# EAGLE design FrequencyCounter (EAGLE 7.2.0)
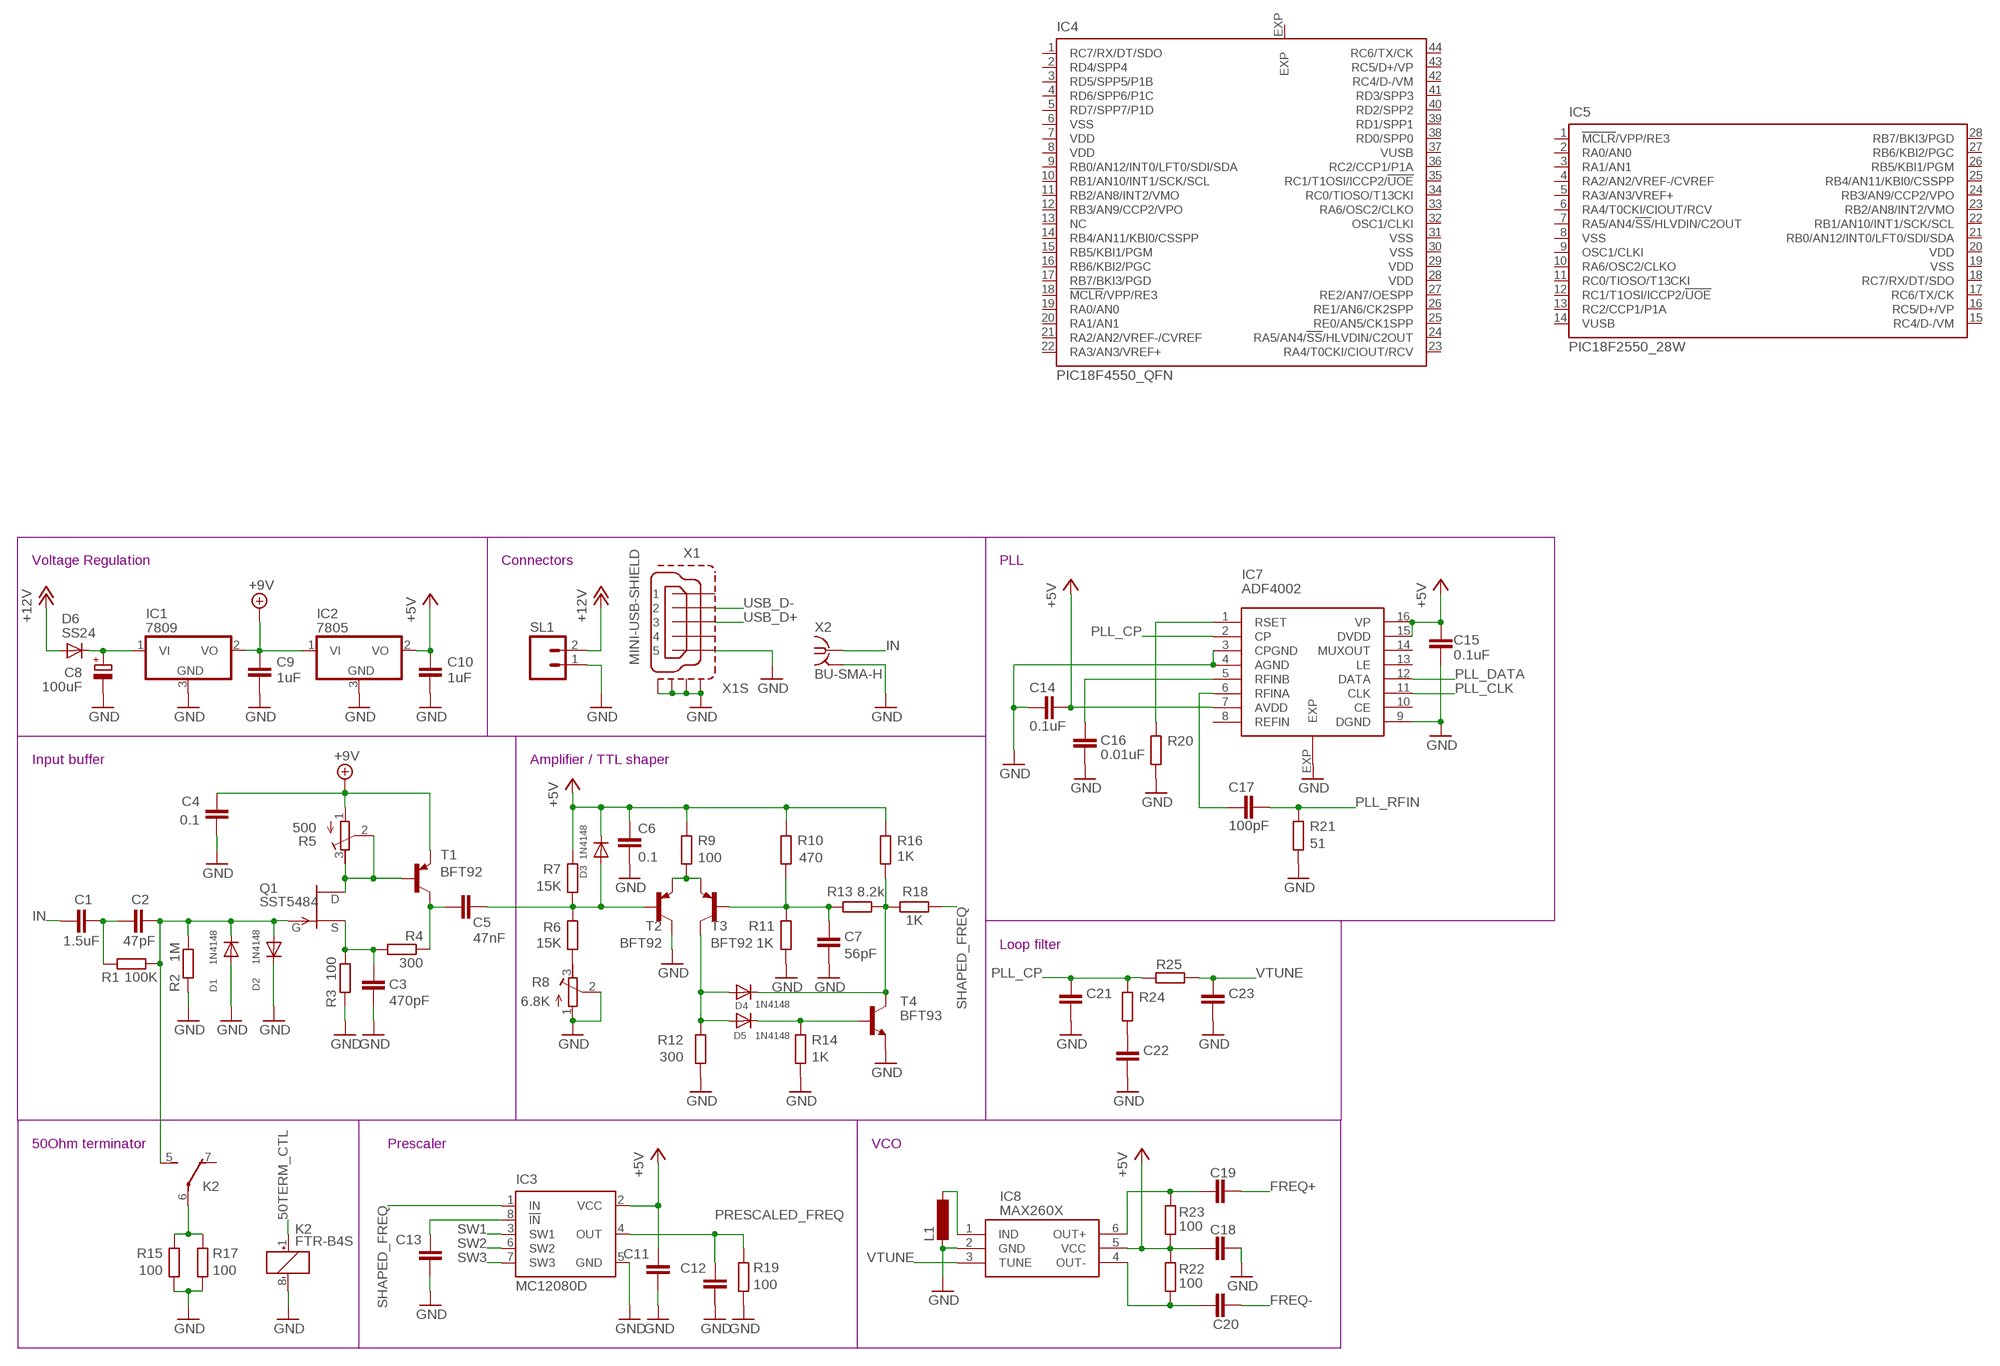
[diagram p0: schematic, sheet 1, part 1 of 2]
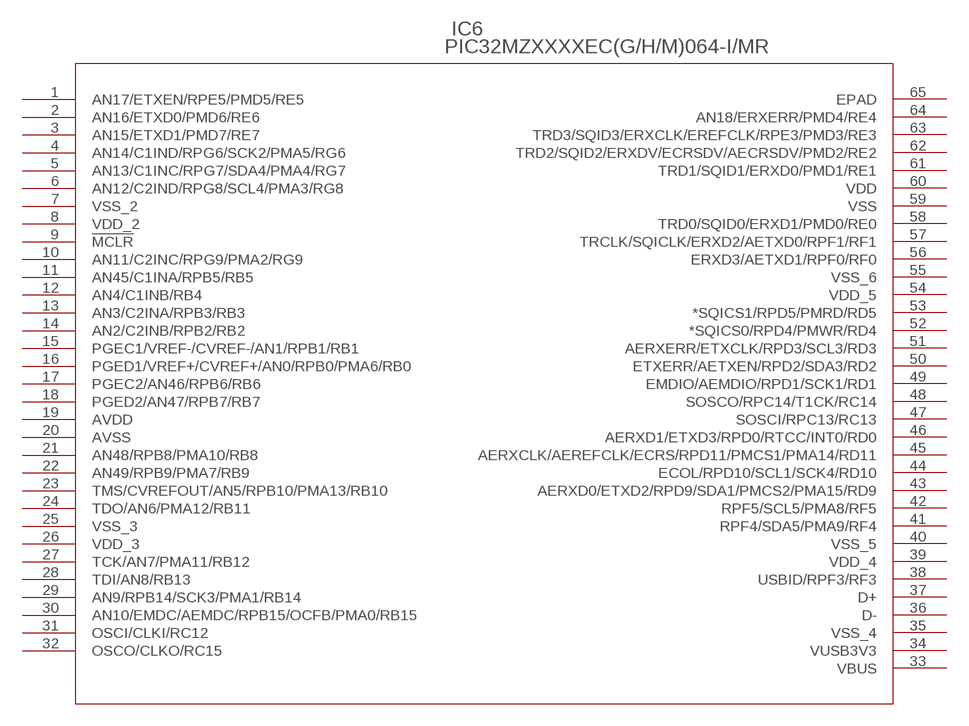
[diagram p1: schematic, sheet 1, part 2 of 2]

## Parts
C1  1.5uF  C-EUC0805  [C0805]
C2  47pF  C-EUC0805  [C0805]
C3  470pF  C-EUC0805  [C0805]
C4  0.1  C-EUC0805  [C0805]
C5  47nF  C-EUC0805  [C0805]
C6  0.1  C-EUC0805  [C0805]
C7  56pF  C-EUC0805  [C0805]
C8  100uF  CPOL-EUD/7343-31R  [D/7343-31R]
C9  1uF  C-EUC0805  [C0805]
C10  1uF  C-EUC0805  [C0805]
C11  C-EUC0805  [C0805]
C12  C-EUC0805  [C0805]
C13  C-EUC0805  [C0805]
C14  0.1uF  C-EUC0805  [C0805]
C15  0.1uF  C-EUC0805  [C0805]
C16  0.01uF  C-EUC0805  [C0805]
C17  100pF  C-EUC0805  [C0805]
C18  C-EUC0805  [C0805]
C19  C-EUC0805  [C0805]
C20  C-EUC0805  [C0805]
C21  C-EUC0805  [C0805]
C22  C-EUC0805  [C0805]
C23  C-EUC0805  [C0805]
D1  1N4148  DIODESOD-123  [SOD-123]
D2  1N4148  DIODESOD-123  [SOD-123]
D3  1N4148  DIODESOD-123  [SOD-123]
D4  1N4148  DIODESOD-123  [SOD-123]
D5  1N4148  DIODESOD-123  [SOD-123]
D6  SS24  DIODE-DO214AA  [DO214AA]
IC1  7809  7806DT  [TO252]
IC2  7805  7806DT  [TO252]
IC3  MC12080D  [SO08]
IC4  PIC18F4550_QFN  [QFN44ML8X8]
IC5  PIC18F2550_28W  [SO28W]
IC6  PIC32MZXXXXEC(G/H/M)064-I/MR  [QFN64_9X9MC]
IC7  ADF4002  ADF4001  [LFCSP16]
IC8  MAX260X  [SOT-23-6]
K2  FTR-B4S  [FTR-B4S]
L1  L-EUL3225P  [L3225P]
Q1  SST5484  [SOT23]
R1  100K  R-EU_R0805  [R0805]
R2  1M  R-EU_R0805  [R0805]
R3  100  R-EU_R0805  [R0805]
R4  300  R-EU_R0805  [R0805]
R5  500  R-TRIMM4G/J  [RTRIM4G/J]
R6  15K  R-EU_R0805  [R0805]
R7  15K  R-EU_R0805  [R0805]
R8  6.8K  R-TRIMM4G/J  [RTRIM4G/J]
R9  100  R-EU_R0805  [R0805]
R10  470  R-EU_R0805  [R0805]
R11  1K  R-EU_R0805  [R0805]
R12  300  R-EU_R0805  [R0805]
R13  8.2k  R-EU_R0805  [R0805]
R14  1K  R-EU_R0805  [R0805]
R15  100  R-EU_R0805  [R0805]
R16  1K  R-EU_R0805  [R0805]
R17  100  R-EU_R0805  [R0805]
R18  1K  R-EU_R0805  [R0805]
R19  100  R-EU_R0805  [R0805]
R20  R-EU_R0805  [R0805]
R21  51  R-EU_R0805  [R0805]
R22  100  R-EU_R0805  [R0805]
R23  100  R-EU_R0805  [R0805]
R24  R-EU_R0805  [R0805]
R25  R-EU_R0805  [R0805]
SL1  M02  [02P]
T1  BFT92  BC807-16-PNP-SOT23-BEC  [SOT23-BEC]
T2  BFT92  BC807-16-PNP-SOT23-BEC  [SOT23-BEC]
T3  BFT92  BC807-16-PNP-SOT23-BEC  [SOT23-BEC]
T4  BFT93  BC808-NPN-SOT23-BEC  [SOT23-BEC]
X1  MINI-USB-SHIELD  MINI-USB-SHIELD-UX60A-MB-5ST  [UX60A-MB-5ST]
X2  BU-SMA-H  [BU-SMA-H]

## Nets
50TERM_CTL: K2.1(K:+)
+5V: C6.1 C10.1 C11.1 C14.1 C15.2 C18.1 D3.C IC2.2(VO) IC3.2(VCC) IC7.7(AVDD) IC7.15(DVDD) IC7.16(VP) IC8.5(VCC) R7.1 R9.1 R10.1 R16.1 R22.2 R23.1
+9V: C4.1 C9.1 IC1.2(VO) IC2.1(VI) R5.1(A) T1.E
+12V: D6.A SL1.2
FREQ+: C19.2
FREQ-: C20.2
GND: C3.2 C4.2 C6.2 C7.1 C8.- C9.2 C10.2 C11.2 C12.2 C13.2 C14.2 C15.1 C16.2 C18.2 C21.1 C22.1 C23.1 D1.A D2.C IC1.3(GND) IC2.3(GND) IC3.5(GND) IC7.3(CPGND) IC7.4(AGND) IC7.9(DGND) IC7.EXP IC8.2(GND) K2.8(K:-) L1.2 R2.2 R3.2 R8.1(A) R8.2(S) R11.2 R12.2 R14.2 R15.2 R17.2 R19.2 R20.2 R21.2 SL1.1 T2.C T4.E X1.5 X1.M1(S1) X1.M2(S2) X1.M3(S3) X1.M4(S4) X2.2 X2.3 X2.4 X2.5
IN: C1.1 X2.1
N$1: C2.2 D1.C D2.A K2.5(-2:S) Q1.3(G) R1.1 R2.1
N$2: C1.2 C2.1 R1.2
N$3: C3.1 Q1.2(S) R3.1 R4.2
N$4: Q1.1(D) R5.2(S) R5.3(E) T1.B
N$5: C5.2 R4.1 T1.C
N$6: R6.2 R8.3(E)
N$7: C5.1 D3.A R6.1 R7.2 T2.B
N$8: R9.2 T2.E T3.E
N$9: C7.2 R10.2 R11.1 R13.2 T3.B
N$10: D4.A D5.A R12.1 T3.C
N$11: D4.C R13.1 R16.2 R18.2 T4.C
N$12: D5.C R14.1 T4.B
N$13: C8.+ D6.C IC1.1(VI)
N$14: K2.6(-2:P) R15.1 R17.1
N$15: C16.1 IC7.5(RFINB)
N$16: C13.1 IC3.8(!IN)
N$17: IC7.1(RSET) R20.1
N$18: C17.2 IC7.6(RFINA)
N$19: IC8.1(IND) L1.1
N$20: C20.1 IC8.4(OUT-) R22.1
N$21: C19.1 IC8.6(OUT+) R23.2
N$22: C22.2 R24.2
PLL_CLK: IC7.11(CLK)
PLL_CP: C21.2 IC7.2(CP) R24.1 R25.1
PLL_DATA: IC7.12(DATA)
PLL_RFIN: C17.1 R21.1
PRESCALED_FREQ: C12.1 IC3.4(OUT) R19.1
SHAPED_FREQ: IC3.1(IN) R18.1
SW1: IC3.3(SW1)
SW2: IC3.6(SW2)
SW3: IC3.7(SW3)
USB_D+: X1.3
USB_D-: X1.2
VTUNE: C23.2 IC8.3(TUNE) R25.2
Unconnected: IC4.1(RC7/RX/DT/SDO) IC4.2(RD4/SPP4) IC4.3(RD5/SPP5/P1B) IC4.4(RD6/SPP6/P1C) IC4.5(RD7/SPP7/P1D) IC4.9(RB0/AN12/INT0/LFT0/SDI/SDA) IC4.10(RB1/AN10/INT1/SCK/SCL) IC4.11(RB2/AN8/INT2/VMO) IC4.12(RB3/AN9/CCP2/VPO) IC4.13(NC) IC4.14(RB4/AN11/KBI0/CSSPP) IC4.15(RB5/KBI1/PGM) IC4.16(RB6/KBI2/PGC) IC4.17(RB7/BKI3/PGD) IC4.18(!MCLR!/VPP/RE3) IC4.19(RA0/AN0) IC4.20(RA1/AN1) IC4.21(RA2/AN2/VREF-/CVREF) IC4.22(RA3/AN3/VREF+) IC4.23(RA4/T0CKI/CIOUT/RCV) IC4.24(RA5/AN4/!SS!/HLVDIN/C2OUT) IC4.25(RE0/AN5/CK1SPP) IC4.26(RE1/AN6/CK2SPP) IC4.27(RE2/AN7/OESPP) IC4.32(OSC1/CLKI) IC4.33(RA6/OSC2/CLKO) IC4.34(RC0/TIOSO/T13CKI) IC4.35(RC1/T1OSI/ICCP2/!UOE) IC4.36(RC2/CCP1/P1A) IC4.37(VUSB) IC4.38(RD0/SPP0) IC4.39(RD1/SPP1) IC4.40(RD2/SPP2) IC4.41(RD3/SPP3) IC4.42(RC4/D-/VM) IC4.43(RC5/D+/VP) IC4.44(RC6/TX/CK) IC4.EXP IC5.1(!MCLR!/VPP/RE3) IC5.2(RA0/AN0) IC5.3(RA1/AN1) IC5.4(RA2/AN2/VREF-/CVREF) IC5.5(RA3/AN3/VREF+) IC5.6(RA4/T0CKI/CIOUT/RCV) IC5.7(RA5/AN4/!SS!/HLVDIN/C2OUT) IC5.9(OSC1/CLKI) IC5.10(RA6/OSC2/CLKO) IC5.11(RC0/TIOSO/T13CKI) IC5.12(RC1/T1OSI/ICCP2/!UOE) IC5.13(RC2/CCP1/P1A) IC5.14(VUSB) IC5.15(RC4/D-/VM) IC5.16(RC5/D+/VP) IC5.17(RC6/TX/CK) IC5.18(RC7/RX/DT/SDO) IC5.21(RB0/AN12/INT0/LFT0/SDI/SDA) IC5.22(RB1/AN10/INT1/SCK/SCL) IC5.23(RB2/AN8/INT2/VMO) IC5.24(RB3/AN9/CCP2/VPO) IC5.25(RB4/AN11/KBI0/CSSPP) IC5.26(RB5/KBI1/PGM) IC5.27(RB6/KBI2/PGC) IC5.28(RB7/BKI3/PGD) IC6.1(AN17/ETXEN/RPE5/PMD5/RE5) IC6.2(AN16/ETXD0/PMD6/RE6) IC6.3(AN15/ETXD1/PMD7/RE7) IC6.4(AN14/C1IND/RPG6/SCK2/PMA5/RG6) IC6.5(AN13/C1INC/RPG7/SDA4/PMA4/RG7) IC6.6(AN12/C2IND/RPG8/SCL4/PMA3/RG8) IC6.9(!MCLR!) IC6.10(AN11/C2INC/RPG9/PMA2/RG9) IC6.11(AN45/C1INA/RPB5/RB5) IC6.12(AN4/C1INB/RB4) IC6.13(AN3/C2INA/RPB3/RB3) IC6.14(AN2/C2INB/RPB2/RB2) IC6.15(PGEC1/VREF-/CVREF-/AN1/RPB1/RB1) IC6.16(PGED1/VREF+/CVREF+/AN0/RPB0/PMA6/RB0) IC6.17(PGEC2/AN46/RPB6/RB6) IC6.18(PGED2/AN47/RPB7/RB7) IC6.21(AN48/RPB8/PMA10/RB8) IC6.22(AN49/RPB9/PMA7/RB9) IC6.23(TMS/CVREFOUT/AN5/RPB10/PMA13/RB10) IC6.24(TDO/AN6/PMA12/RB11) IC6.27(TCK/AN7/PMA11/RB12) IC6.28(TDI/AN8/RB13) IC6.29(AN9/RPB14/SCK3/PMA1/RB14) IC6.30(AN10/EMDC/AEMDC/RPB15/OCFB/PMA0/RB15) IC6.31(OSCI/CLKI/RC12) IC6.32(OSCO/CLKO/RC15) IC6.36(D-) IC6.37(D+) IC6.38(USBID/RPF3/RF3) IC6.41(RPF4/SDA5/PMA9/RF4) IC6.42(RPF5/SCL5/PMA8/RF5) IC6.43(AERXD0/ETXD2/RPD9/SDA1/PMCS2/PMA15/RD9) IC6.44(ECOL/RPD10/SCL1/SCK4/RD10) IC6.45(AERXCLK/AEREFCLK/ECRS/RPD11/PMCS1/PMA14/RD11) IC6.46(AERXD1/ETXD3/RPD0/RTCC/INT0/RD0) IC6.47(SOSCI/RPC13/RC13) IC6.48(SOSCO/RPC14/T1CK/RC14) IC6.49(EMDIO/AEMDIO/RPD1/SCK1/RD1) IC6.50(ETXERR/AETXEN/RPD2/SDA3/RD2) IC6.51(AERXERR/ETXCLK/RPD3/SCL3/RD3) IC6.52(*SQICS0/RPD4/PMWR/RD4) IC6.53(*SQICS1/RPD5/PMRD/RD5) IC6.56(ERXD3/AETXD1/RPF0/RF0) IC6.57(TRCLK/SQICLK/ERXD2/AETXD0/RPF1/RF1) IC6.58(TRD0/SQID0/ERXD1/PMD0/RE0) IC6.61(TRD1/SQID1/ERXD0/PMD1/RE1) IC6.62(TRD2/SQID2/ERXDV/ECRSDV/AECRSDV/PMD2/RE2) IC6.63(TRD3/SQID3/ERXCLK/EREFCLK/RPE3/PMD3/RE3) IC6.64(AN18/ERXERR/PMD4/RE4) IC6.65(EPAD) IC7.8(REFIN) IC7.10(CE) IC7.13(LE) IC7.14(MUXOUT) K2.2(-1:O) K2.3(-1:P) K2.4(-1:S) K2.7(-2:O) X1.1 X1.4

## Notes on the sheet
- Voltage Regulation | Connectors | PLL
- Input buffer | Amplifier / TTL shaper
- Loop filter
- 50Ohm terminator | Prescaler | VCO

## Power pins joined to a net without a drawn wire
AVDD: IC6.19(AVDD)
AVSS: IC6.20(AVSS)
VBUS: IC6.33(VBUS)
VDD: IC4.7(VDD) IC4.8(VDD) IC4.28(VDD) IC4.29(VDD) IC5.20(VDD) IC6.60(VDD)
VDD_2: IC6.8(VDD_2)
VDD_3: IC6.26(VDD_3)
VDD_4: IC6.39(VDD_4)
VDD_5: IC6.54(VDD_5)
VSS: IC4.6(VSS) IC4.30(VSS) IC4.31(VSS) IC5.8(VSS) IC5.19(VSS) IC6.59(VSS)
VSS_2: IC6.7(VSS_2)
VSS_3: IC6.25(VSS_3)
VSS_4: IC6.35(VSS_4)
VSS_5: IC6.40(VSS_5)
VSS_6: IC6.55(VSS_6)
VUSB3V3: IC6.34(VUSB3V3)

## Library data of the parts
C1-C7 C9-C23 = rcl:C-EU: CAPACITOR, European symbol
C8 = rcl:CPOL-EU: POLARIZED CAPACITOR, European symbol
D1-D5 = adafruit:DIODE: Diode SMADIODE - SMA Surface Mount Package 20V 1A Schottky Diode Digikey: 641-1014-6-ND DO-1N4148 - Through Hole Small Current Diode SOD-123 20V 1 A (.5mV Vf) Schottky Diode - Digikey: MBRX120TPMSCT-ND SOD-323 10V 570mA (.38mV Vf, 3ns) Schottky Diode - Digikey: ZLLS410CT-ND SOD-523 30V 30mA Schottky Diode (RB751S-40TE61) - Digikey: RB751S-40TE61CT-ND SOT23-R/W - SOT23 Package (R = Solder Paste/Reflow Ovens, W = Hand-Soldering) BAT54Film 40V 300mA - Digikey: 497-7162-1-ND
D6 = diode:DIODE-: DIODE
IC1 IC2 = linear:78*: Positive VOLTAGE REGULATOR Source: http://cache.national.com/ds/LM/LM78L05.pdf http://www.fairchildsemi.com/ds/LM/LM7805.pdf
IC3 = on-semiconductor:MC12080: 1.1 GHz Prescaler MECL PLL COMPONENTS ÷10/20/40/80 PRESCALER Source: http://motorola.com/sps .. MC12080.pdf; MF: ON SEMICONDUCTOR; MPN: MC12080D; OC_FARNELL: 1607924; OC_NEWARK: 40C2542
IC4 = microchip:PIC18F4*_QFN: USB Microcontrollers with nanoWatt Technology High-Performance, Enhanced Flash, 28/40/44-Pin, Source: http://ww1.microchip.com/downloads/en/devicedoc/39632c.pdf; MF: MICROCHIP; MPN: PIC18F4550-I/ML; OC_FARNELL: 1292276; OC_NEWARK: 08J9631
IC5 = microchip:PIC18F2*_28: USB Microcontrollers with nanoWatt Technology High-Performance, Enhanced Flash, 28/40/44-Pin, Source: http://ww1.microchip.com/downloads/en/devicedoc/39632c.pdf; MF: MICROCHIP; MPN: PIC18F2550-I/SO; OC_FARNELL: 9321268; OC_NEWARK: 73K1297
IC6 = own-collection:PIC32MZXXXXEC(G/H/M)064-I/MR; MANUFACTURER_PART_NUMBER: pic32mz1024ecg064-i/mr; VENDOR: Microchip
IC7 = own-collection:ADF4001
IC8 = own-collection:MAX260X: MAX2605–MAX2609 45MHz to 650MHz, Integrated IF VCOs with Differential Output
K2 = relay:FTR-B4: ULTRA MINIATURE RELAY 2 POLES - 2 A (Slim Profile Signal Relay) FUJITSU FTR-B4 SERIES Source: FTR-B4.pdf
L1 = rcl:L-EU: INDUCTOR, European symbol
Q1 = transistor-fet:?548*: N-Channel JFETs Source: VISHAY 2N5484.pdf Compatible: TO92 2N5245 J304 J305 U310 J308 J309 J310 TO72 2N4416 2N4416A 2N3823 2N4351 3N169 3N170 3N171 MFE3002 TO18 2N3796 2N3797 MFE825 Source: Motorola European Master Guide Pacge 3-59
R1-R4 R6 R7 R9-R25 = rcl:R-EU_: RESISTOR, European symbol
R5 R8 = rcl:R-TRIMM: Trimm resistor
SL1 = con-amp-quick:M02: AMP QUICK CONNECTOR; OC_FARNELL: unknown; OC_NEWARK: unknown
T1-T3 = transistor:*-PNP-: PNP Transistror
T4 = transistor:*-NPN-: NPN Transistror BF959 corrected 2008.03.06
X1 = con-hirose:MINI-USB-SHIELD-: MINI USB Connector Source: http://www.hirose.co.jp/cataloge_hp/e24000019.pdf; OC_FARNELL: unknown; OC_NEWARK: unknown
X2 = con-coax:BU-SMA-H: FEMALE SMA CONNECTOR Radiall; OC_FARNELL: unknown; OC_NEWARK: unknown

## Board
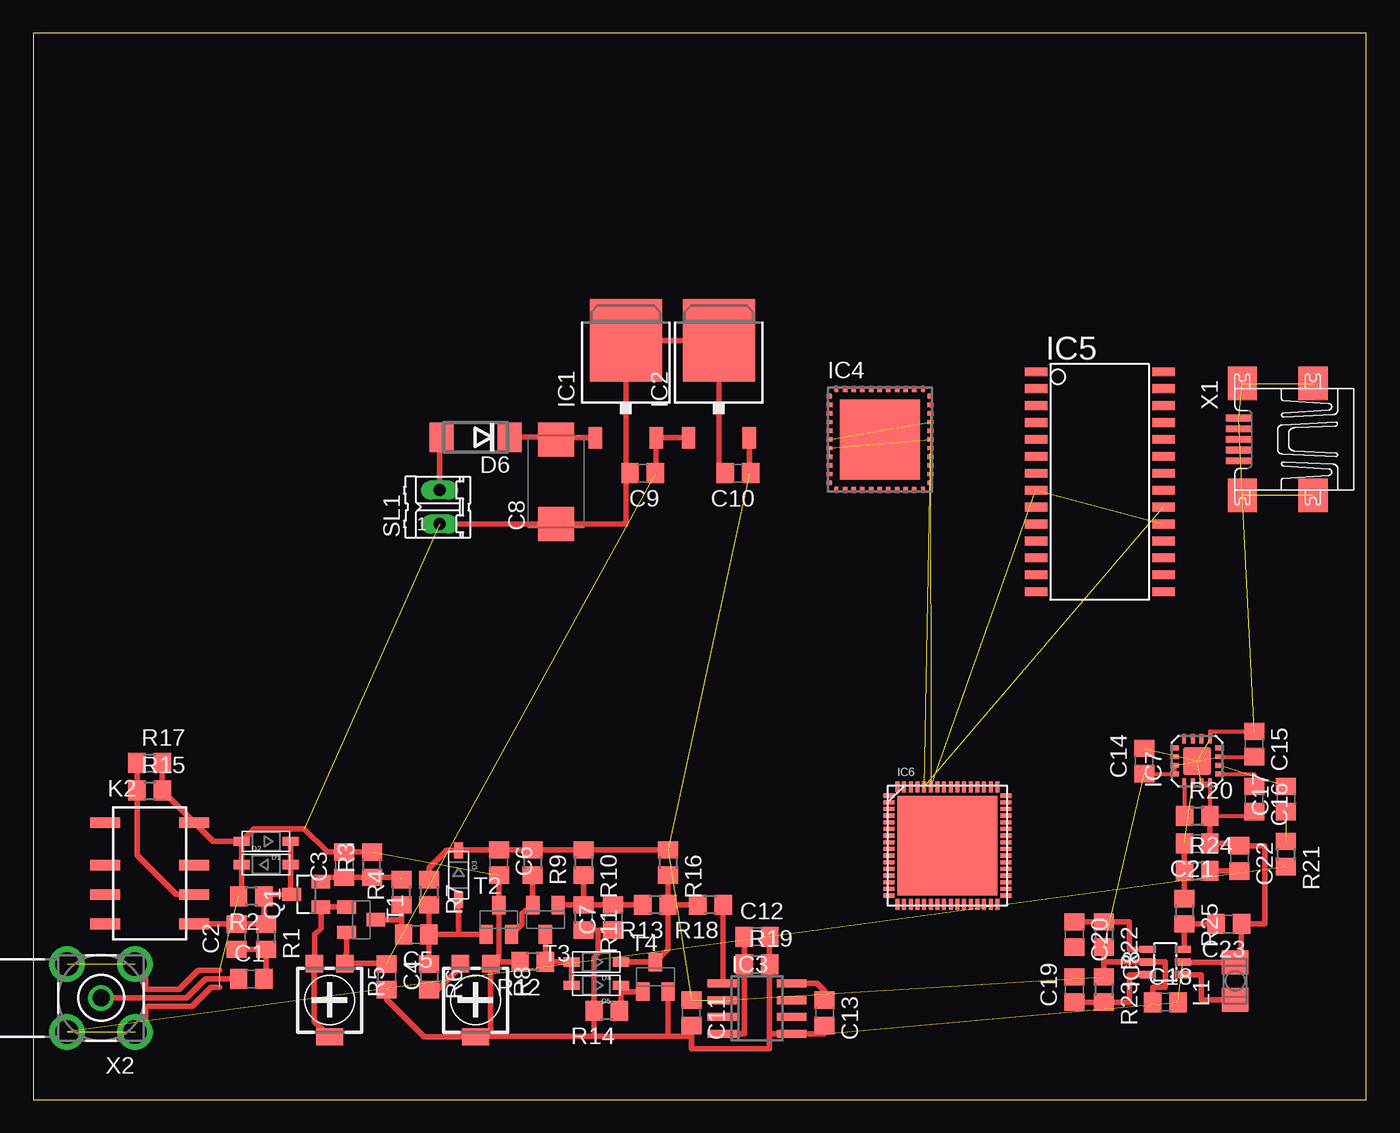
[diagram p2: board, top side]

Size 100 x 80 mm. Coordinates in mm from the lower left corner, seen from the top.
Outline: 0,0 100,0 100,80 0,80 0,0
Copper layers (1*16): Top 0.035mm / dielectric 1.5mm / Bottom 0.035mm
Design rules "default *": minimum track width 10mil, minimum drill 24mil, track to track 6mil, track to pad 6mil, pad to pad 6mil, via to via 6mil, smd to smd 6mil, copper to edge 40mil, drill to drill 8mil, minimum pad ring 10mil, minimum via ring 8mil, stop-mask expansion 4mil, vias tented up to drill 0mil, thermal gap 10mil

### Footprints (pad centres in the part's own frame; a part is rotated, then mirrored left to right if it is on the bottom)
C0805 = smd 1.3 x 1.5: 1 -0.95,0; 2 0.95,0
D/7343-31R = smd 2.55 x 2.7: + 3.175,0; - -3.175,0
SOD-123 = smd 1.2 x 0.7: A 1.85,0; C -1.85,0
DO214AA = smd 1.8 x 2.2: A 2.55,0; C -2.55,0
TO252 = smd 1 x 1.6: 1 -2.28,-4.8; 2 2.28,-4.8 | smd 5.4 x 6.2: 3 0,2.5
SO08 = smd 0.6 x 2.2: 1 -1.905,-2.6; 2 -0.635,-2.6; 3 0.635,-2.6; 4 1.905,-2.6; 5 1.905,2.6; 6 0.635,2.6; 7 -0.635,2.6; 8 -1.905,2.6
QFN44ML8X8 = smd 0.45 x 0.33: 1 -3.788,3.25; 2 -3.788,2.6; 3 -3.788,1.95; 4 -3.788,1.3; 5 -3.788,0.65; 6 -3.788,0; 7 -3.788,-0.65; 8 -3.788,-1.3; 9 -3.788,-1.95; 10 -3.788,-2.6; 11 -3.788,-3.25; 23 3.788,-3.25; 24 3.788,-2.6; 25 3.788,-1.95; 26 3.788,-1.3; 27 3.788,-0.65; 28 3.788,0; 29 3.788,0.65; 30 3.788,1.3; 31 3.788,1.95; 32 3.788,2.6; 33 3.788,3.25 | smd 0.33 x 0.45: 12 -3.25,-3.788; 13 -2.6,-3.788; 14 -1.95,-3.788; 15 -1.3,-3.788; 16 -0.65,-3.788; 17 0,-3.788; 18 0.65,-3.788; 19 1.3,-3.788; 20 1.95,-3.788; 21 2.6,-3.788; 22 3.25,-3.788; 34 3.25,3.788; 35 2.6,3.788; 36 1.95,3.788; 37 1.3,3.788; 38 0.65,3.788; 39 0,3.788; 40 -0.65,3.788; 41 -1.3,3.788; 42 -1.95,3.788; 43 -2.6,3.788; 44 -3.25,3.788 | smd 6 x 6: EXP 0,0
SO28W = smd 0.65 x 1.7: 1 -7.62,-4.78; 2 -6.35,-4.78; 3 -5.08,-4.78; 4 -3.81,-4.78; 5 -2.54,-4.78; 6 -1.27,-4.78; 7 0,-4.78; 8 1.27,-4.78; 9 2.54,-4.78; 10 3.81,-4.78; 11 5.08,-4.78; 12 6.35,-4.78; 13 7.62,-4.78; 14 8.89,-4.78; 15 8.89,4.78; 16 7.62,4.78; 17 6.35,4.78; 18 5.08,4.78; 19 3.81,4.78; 20 2.54,4.78; 21 1.27,4.78; 22 0,4.78; 23 -1.27,4.78; 24 -2.54,4.78; 25 -3.81,4.78; 26 -5.08,4.78; 27 -6.35,4.78; 28 -7.62,4.78
QFN64_9X9MC = smd 0.813 x 0.305: 1 -4.394,3.75; 2 -4.394,3.25; 3 -4.394,2.75; 4 -4.394,2.25; 5 -4.394,1.75; 6 -4.394,1.25; 7 -4.394,0.75; 8 -4.394,0.25; 9 -4.394,-0.25; 10 -4.394,-0.75; 11 -4.394,-1.25; 12 -4.394,-1.75; 13 -4.394,-2.25; 14 -4.394,-2.75; 15 -4.394,-3.25; 16 -4.394,-3.75; 33 4.394,-3.75; 34 4.394,-3.25; 35 4.394,-2.75; 36 4.394,-2.25; 37 4.394,-1.75; 38 4.394,-1.25; 39 4.394,-0.75; 40 4.394,-0.25; 41 4.394,0.25; 42 4.394,0.75; 43 4.394,1.25; 44 4.394,1.75; 45 4.394,2.25; 46 4.394,2.75; 47 4.394,3.25; 48 4.394,3.75 | smd 0.305 x 0.813: 17 -3.75,-4.394; 18 -3.25,-4.394; 19 -2.75,-4.394; 20 -2.25,-4.394; 21 -1.75,-4.394; 22 -1.25,-4.394; 23 -0.75,-4.394; 24 -0.25,-4.394; 25 0.25,-4.394; 26 0.75,-4.394; 27 1.25,-4.394; 28 1.75,-4.394; 29 2.25,-4.394; 30 2.75,-4.394; 31 3.25,-4.394; 32 3.75,-4.394; 49 3.75,4.394; 50 3.25,4.394; 51 2.75,4.394; 52 2.25,4.394; 53 1.75,4.394; 54 1.25,4.394; 55 0.75,4.394; 56 0.25,4.394; 57 -0.25,4.394; 58 -0.75,4.394; 59 -1.25,4.394; 60 -1.75,4.394; 61 -2.25,4.394; 62 -2.75,4.394; 63 -3.25,4.394; 64 -3.75,4.394 | smd 7.493 x 7.493: 65 0,0
LFCSP16 = smd 0.7 x 0.35: 1 -1.675,0.975; 2 -1.675,0.325; 3 -1.675,-0.325; 4 -1.675,-0.975; 9 1.675,-0.975; 10 1.675,-0.325; 11 1.675,0.325; 12 1.675,0.975 | smd 0.35 x 0.7: 5 -0.975,-1.675; 6 -0.325,-1.675; 7 0.325,-1.675; 8 0.975,-1.675; 13 0.975,1.675; 14 0.325,1.675; 15 -0.325,1.675; 16 -0.975,1.675 | smd 2.1 x 2.1: EXP 0,0
SOT-23-6 = smd 0.55 x 1.2: 1 -0.95,-1.3; 2 0,-1.3; 3 0.95,-1.3; 4 0.95,1.3; 5 0,1.3; 6 -0.95,1.3
FTR-B4S = smd 0.8 x 2.25: 1 -3.8,-3.345; 2 -0.6,-3.345; 3 1.6,-3.345; 4 3.8,-3.345; 5 3.8,3.345; 6 1.6,3.345; 7 -0.6,3.345; 8 -3.8,3.345
L3225P = smd 1.8 x 2: 1 -1.4,0; 2 1.4,0
SOT23 = smd 1 x 1.4: 1 -0.95,-1.1; 2 0.95,-1.1; 3 0,1.1
R0805 = smd 1.3 x 1.5: 1 -0.95,0; 2 0.95,0
RTRIM4G/J = smd 1.3 x 1.3: 1 -1.15,-2.75; 3 1.15,-2.75 | smd 2 x 1.3: 2 0,2.75
02P = drill 0.914 long: 1 -1.27,0; 2 1.27,0
SOT23-BEC = smd 1 x 1.4: B -0.95,-1.1; C 0,1.1; E 0.95,-1.1
UX60A-MB-5ST = smd 2 x 0.5: 1 2.25,1.6; 2 2.25,0.8; 3 2.25,0; 4 2.25,-0.8; 5 2.25,-1.6 | smd 2.2 x 2.5: M1 -3.3,-4.2; M2 -3.3,4.2; M3 2,4.2; M4 2,-4.2
BU-SMA-H = drill 1.27: 1 0,0 | drill 1.778: 2 -2.55,2.55; 3 2.55,2.55; 4 2.55,-2.55; 5 -2.55,-2.55

### Placement (x,y rotation side)
C1  16.35,9.05 0 top
C2  15.24,12.22 90 top
C3  23.34,17.62 90 top
C4  26.51,9.21 270 top
C5  28.73,12.38 180 top
C6  34.92,17.78 270 top
C7  43.5,13.65 90 top
C8  39.21,46.35 90 top
C9  45.72,46.99 180 top
C10  52.86,46.99 180 top
C11  49.37,6.51 270 top
C12  54.29,12.22 0 top
C13  59.37,6.51 270 top
C14  83.34,25.4 90 top
C15  91.6,26.67 270 top
C16  91.6,22.54 270 top
C17  93.98,22.54 90 top
C18  84.93,7.3 0 top
C19  78.11,8.26 90 top
C20  78.11,12.38 270 top
C21  87.31,19.21 180 top
C22  90.49,18.1 270 top
C23  89.69,13.18 180 top
D1  17.46,19.37 180 top
D2  17.46,17.62 0 top
D3  31.91,16.83 270 top
D4  42.23,10.32 180 top
D5  42.23,8.57 180 top
D6  33.18,49.69 180 top
IC1  44.45,54.45 0 top
IC2  51.44,54.45 0 top
IC3  54.29,6.83 270 top
IC4  63.5,49.53 0 top
IC5  80.01,46.99 270 top
IC6  68.58,19.05 0 top
IC7  87.31,25.4 90 top
IC8  84.93,10.32 90 top
K2  8.73,16.99 270 top
L1  90.17,8.89 90 top
Q1  20.48,15.4 90 top
R1  17.46,12.22 270 top
R2  16.35,15.24 180 top
R3  25.4,17.62 90 top
R4  27.62,15.56 90 top
R5  22.23,7.46 180 top
R6  29.69,9.21 270 top
R7  29.69,15.56 270 top
R8  33.18,7.46 180 top
R9  37.47,17.78 270 top
R10  41.27,17.78 270 top
R11  41.27,13.65 270 top
R12  37.47,10.32 180 top
R13  46.67,14.61 180 top
R14  43.02,6.67 180 top
R15  8.73,23.18 0 top
R16  47.62,17.78 270 top
R17  8.73,25.24 0 top
R18  50.8,14.61 180 top
R19  54.29,10.16 0 top
R20  87.31,21.27 0 top
R21  93.98,18.41 270 top
R22  80.33,12.38 270 top
R23  80.33,8.26 270 top
R24  87.31,17.14 0 top
R25  86.36,14.13 270 top
SL1  30.48,44.45 90 top
T1  24.61,13.49 270 top
T2  34.92,13.49 0 top
T3  38.42,13.49 180 top
T4  46.67,9.21 0 top
X1  92.71,49.53 180 top
X2  5.08,7.62 180 top

### Tracks (layer width: path | path; a pad name or v marks a point on that pad's centre or on a via)
+5V  (6 unrouted)
  Top 0.305: IC7.7 C15.2 | C14.1 85.64,24.45 IC7.16 IC7.15
  Top 0.406: R16.1 R10.1 R9.1 C6.1 31.91,18.73 D3.C 31,18.68 29.69,17.37 R7.1 | C10.1 53.72,46.99 IC2.2 | C18.1 83.98,8.41 84.93,8.41 84.93,10.32 IC8.5 80.33,10.32 R22.2 R23.1
+9V  (1 unrouted)
  Top 0.406: T1.E 23.51,11.16 R5.1 26.51,10.21 C4.1 | IC2.1 IC1.2 46.73,46.99 C9.1
+12V
  Top 0.406: SL1.2 30.48,50.01 D6.A
GND  (17 unrouted)
  Top 0.305: IC7.9 88.29,27.62 C15.1 | IC7.3 IC7.4 88.29,21.27 91.6,21.27 C16.2
  Top 0.406: R3.2 C3.2 22.07,18.57 20.32,20.32 16.57,20.32 D1.A | C6.2 T2.C 34.92,10.32 | R12.2 34.92,10.32 | 34.92,10.32 34.33,10.32 R8.1 34.29,10.21 34.29,4.76 | C7.1 42.39,12.7 | 42.39,12.7 R11.2 | 42.39,12.7 42.39,10.95 42.07,10.64 R14.2 | R14.2 | R2.2 15.61,15.24 D2.C D1.A | 34.29,4.76 33.23,4.76 R8.2 29.32,4.71 26.51,7.51 C4.2 | 34.29,4.76 42.07,4.76 | 42.07,4.76 47.62,4.76 | R14.2 42.07,4.76 | SL1.1 C8.- 44.45,43.18 44.45,46.99 | 44.45,46.99 IC1.3 IC2.3 51.44,46.99 C10.2 | C9.2 44.45,46.99 | C12.2 R19.2 55.24,4.92 | 55.24,4.92 IC3.5 59.37,4.92 C13.2 | 47.62,4.76 T4.E | 55.24,4.92 55.24,3.81 49.37,3.81 49.37,4.76 | C11.2 49.37,4.76 | 47.62,4.76 49.37,4.76 | R17.2 R15.2 K2.8 13.49,19.37 D1.A | X2.5 8.41,9.39 8.41,8.26 10.95,8.26 12.38,9.68 13.97,9.68 | X2.2 8.26,5.7 8.26,5.87 8.41,6.03 8.41,6.99 11.91,6.99 13.34,8.41 13.97,8.41 | 88.29,21.27 R20.2 C21.1 90.49,19.21 C22.1 92.39,19.05 92.39,13.18 C23.1 90.64,10.29 L1.2 86.23,10.29 IC8.2
IN
  Top 0.406: X2.1 11.49,7.62 12.92,9.05 C1.1
N$1
  Top 0.406: D1.C D2.A 19.31,15.4 Q1.3 17.3,15.4 R2.1 17.3,13.17 R1.1 C2.2 12.08,13.17 K2.5
N$2
  Top 0.406: C2.1 R1.2 17.46,9.21 C1.2
N$3  (1 unrouted)
  Top 0.406: Q1.2 21.58,16.67 C3.1 R3.1 27.47,16.67
N$4
  Top 0.406: T1.B Q1.1 21.58,12.86 21.11,12.38 21.11,11.16 R5.3 21.07,5.86 R5.2
N$5
  Top 0.406: T1.C 27.62,13.49 | 27.62,13.49 R4.1 | C5.2 27.62,12.38 27.62,13.49
N$6
  Top 0.406: R6.2 30.36,8.26 32.03,9.93 R8.3
N$7
  Top 0.406: C5.1 29.68,15.08 R7.2 | D3.A 31.91,12.38 | 31.91,12.38 C5.1 | T2.B 33.82,12.38 31.91,12.38 | R6.1 C5.1
N$8
  Top 0.406: R9.2 T3.E 37.47,14.61 36.67,13.97 36.67,13.19 T2.E
N$9
  Top 0.406: T3.B 39.38,14.6 R11.1 | R11.1 R10.2 | R11.1 C7.2 R13.2
N$10
  Top 0.406: T3.C R12.1 D4.A D5.A
N$11
  Top 0.406: D4.C T4.C 47.62,11.26 R13.1 | R13.1 R16.2 | R18.2 R13.1
N$12
  Top 0.406: R14.1 44.08,6.67 D5.C 44.13,8.57 44.13,8.1 45.72,8.1 T4.B
N$13
  Top 0.406: IC1.1 39.21,49.65 C8.+ 39.21,49.69 D6.C
N$14
  Top 0.406: K2.6 10.71,15.39 7.78,18.31 R15.1 R17.1
N$15
  Top 0.305: IC7.5 91.6,24.43 C16.1
N$16
  Top 0.406: C13.1 59.37,8.16 58.8,8.73 IC3.8
N$17
  Top 0.305: IC7.1 86.36,23.73 R20.1
N$18  (1 unrouted)
N$19
  Top 0.406: IC8.1 87.63,9.37 87.63,7.49 L1.1
N$20
  Top 0.406: IC8.4 82.23,11.27 82.23,13.33 R22.1 C20.1
N$21
  Top 0.406: IC8.6 82.23,9.37 82.23,7.3 R23.2 C19.1
N$22
  Top 0.406: C22.2 R24.2
PLL_CP  (1 unrouted)
  Top 0.406: C21.2 R24.1 R25.1
PLL_RFIN  (1 unrouted)
PRESCALED_FREQ
  Top 0.406: C12.1 R19.1 53.34,4.92 IC3.4
SHAPED_FREQ
  Top 0.406: R18.1 51.75,8.73 IC3.1
VDD  (5 unrouted)
VSS  (5 unrouted)
VTUNE
  Top 0.406: C23.2 R25.2 86.36,11.27 IC8.3